# Altium schematic sheet lv.SchDoc
size A3
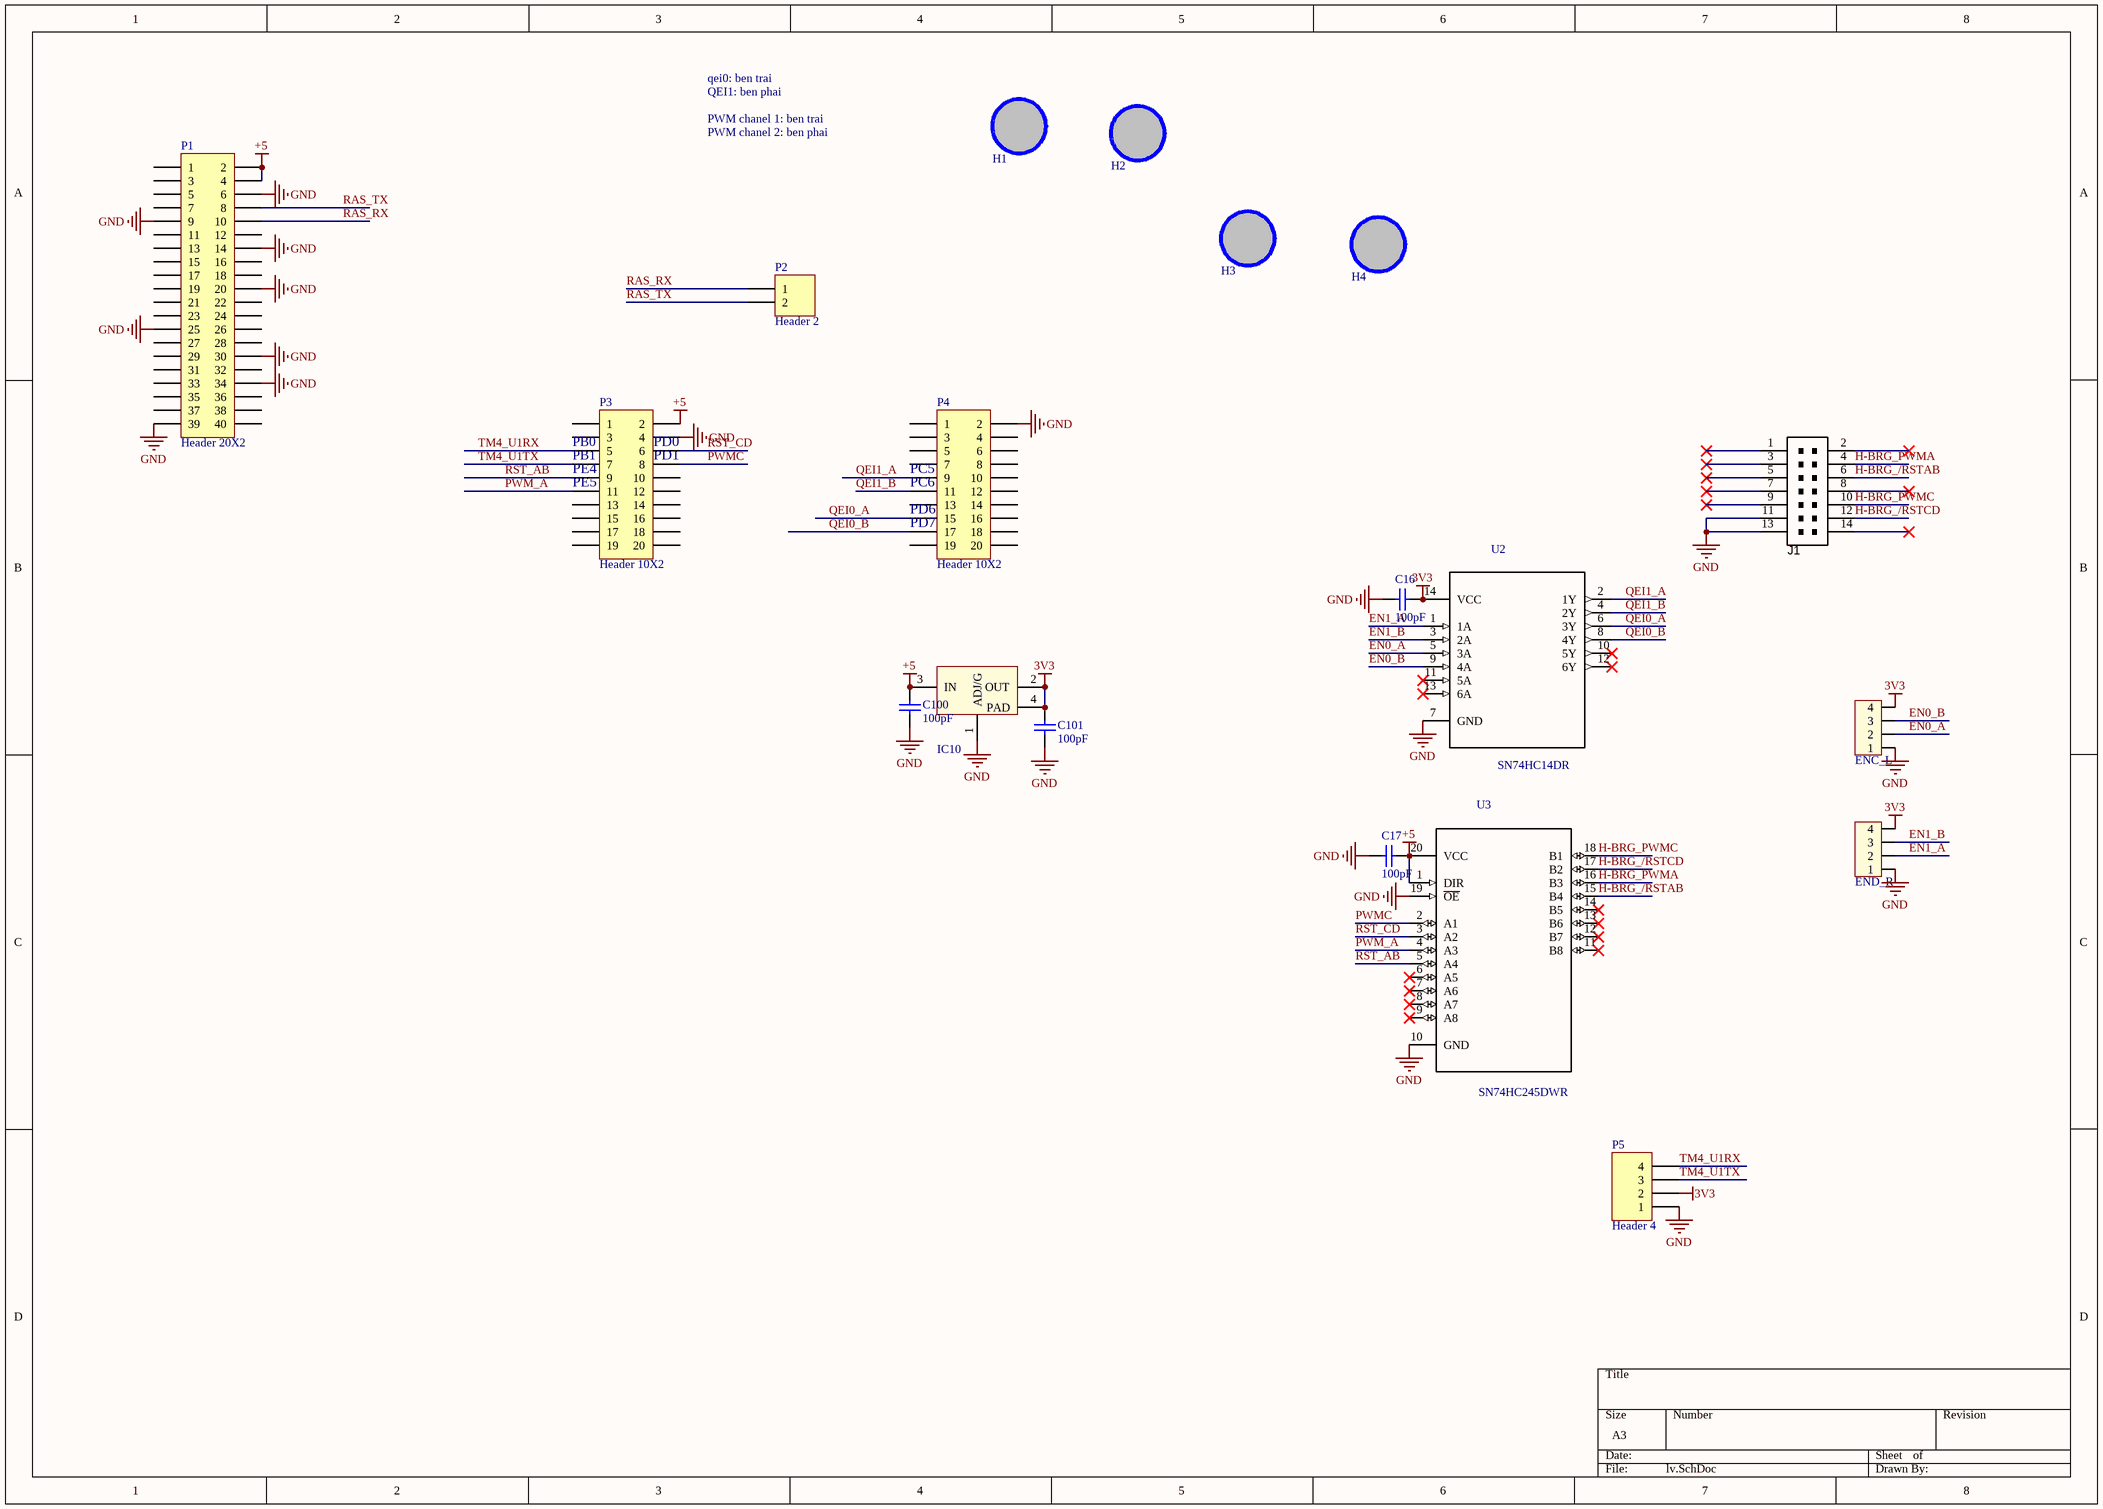
[diagram p0: lv.SchDoc]

## Parts
C16  value 100pF  [CAP-SM-0805]  (hidden comment: Cap Non-Pol SMD)
C17  value 100pF  [CAP-SM-0805]  (hidden comment: Cap Non-Pol SMD)
C100  value 100pF  [CAP-SM-0805]  (hidden comment: Cap Non-Pol SMD)
C101  value 100pF  [CAP-SM-0805]  (hidden comment: Cap Non-Pol SMD)
ENC_L1  ENC_L  [CON4]
END_R1  END_R  [CON4]
H1  Hole  [LO KHOAN 3MM]  (value not drawn)
H2  Hole  [LO KHOAN 3MM]  (value not drawn)
H3  Hole  [LO KHOAN 3MM]  (value not drawn)
H4  Hole  [LO KHOAN 3MM]  (value not drawn)
IC10  LM1117  [SOT223-4N]  (value not drawn)
J1  shrouded box header  [14P_PCB_HEADER_BRD_MNT_RA]  (value not drawn)
P1  Header 20X2  [HDR2X20]
P2  Header 2  [HDR1X2]
P3  Header 10X2  [HDR2X10]
P4  Header 10X2  [HDR2X10]
P5  Header 4  [HDR1X4]
U2  SN74HC14DR  [*SOIC127P600X175-14N]
U3  SN74HC245DWR  [*SOIC127P1030X265-20N]

## Nets
3V3: C16.1 C101.2 ENC_L1.4 END_R1.4 IC10.2(OUT) IC10.4(PAD) P5.2 U2.14(VCC)
+5: C17.1 C100.2 IC10.3(IN) P1.2 P1.4 P3.2 U3.1(DIR) U3.20(VCC)
GND: C16.2 C17.2 C100.1 C101.1 ENC_L1.1 END_R1.1 IC10.1(ADJ/G) J1.11 J1.13 P1.6 P1.9 P1.14 P1.20 P1.25 P1.30 P1.34 P1.39 P3.4 P4.2 P5.1 U2.7(GND) U3.10(GND) U3.19(~{OE})
EN0_A: ENC_L1.2 U2.5(3A)
EN0_B: ENC_L1.3 U2.9(4A)
EN1_A: END_R1.2 U2.1(1A)
EN1_B: END_R1.3 U2.3(2A)
H-BRG_/RSTAB: J1.6 U3.15(B4)
H-BRG_/RSTCD: J1.12 U3.17(B2)
H-BRG_PWMA: J1.4 U3.16(B3)
H-BRG_PWMC: J1.10 U3.18(B1)
PWM_A: P3.11 U3.4(A3)
PWMC: P3.8 U3.2(A1)
QEI0_A: P4.15 U2.6(3Y)
QEI0_B: P4.17 U2.8(4Y)
QEI1_A: P4.9 U2.2(1Y)
QEI1_B: P4.11 U2.4(2Y)
RAS_RX: P1.10 P2.1
RAS_TX: P1.8 P2.2
RST_AB: P3.9 U3.5(A4)
RST_CD: P3.6 U3.3(A2)
TM4_U1RX: P3.5 P5.4
TM4_U1TX: P3.7 P5.3

Not connected (* = marked no-connect by the designer): H1 1; H2 1; H3 1; H4 1; J1 1* 2* 3* 5* 7* 8* 9* 14*; P1 1 3 5 7 11 12 13 15 16 17 18 19 21 22 23 24 26 27 28 29 31 32 33 35 36 37 38 40; P3 1 3 10 12 13 14 15 16 17 18 19 20; P4 1 3 4 5 6 7 8 10 12 13 14 16 18 19 20; U2 10(5Y)* 11(5A)* 12(6Y)* 13(6A)*; U3 6(A5)* 7(A6)* 8(A7)* 9(A8)* 11(B8)* 12(B7)* 13(B6)* 14(B5)*

## Notes on the sheet
- qei0: ben trai
- QEI1: ben phai
- PWM chanel 1: ben trai
- PWM chanel 2: ben phai
- (near P3) PB0
- (near P3) PD0
- (near P3) PE4
- (near P3) PE5
- (near P3) PB1
- (near P3) PD1
- (near P4) PC5
- (near P4) PC6
- (near P4) PD6
- (near P4) PD7

## Library data of the parts
C16 C17 C100 C101 = Cap Non-Pol SMD: Capacitor
ENC_L1 END_R1 = Con4: Connector 4; Value: Connector 4
H1-H4 = Hole: Hole 3mm
IC10 = LM1117: Available in 1.8V, 2.5V, 2.85V, 3.3V, 5V, and  Adjustable Versions; Value: LM317
J1 = CONN_HEADER_2x7P_RA_0.100in_Male: Header THD 14 POS Double-row right-angle 2.54mm pitch; Manufacturer 1: 3M; Manufacturer Part Number 1: D2514-5002-AR; Pitch: 0.100" (2.54mm); Value: Double-row, 14 positions; QtyOverride: 1; Connector Type: Header, Shrouded; Number of Positions: 14; SCDType: source; Package / Case: Connector header; 2.54mm pitch; Contact Type: Male Pin; Number of Rows: 2; Row Spacing: 0.100" (2.54mm); Contact Mating Length: 0.243" (6.17mm); ComponentLink1URL: http://multimedia.3m.com/mws/mediawebserver?66666UuZjcFSLXTtm8T_oxMcEVuQEcuZgVs6EVs6E666666--; ComponentLink1Description: http://multimedia.3m.com/mws/mediawebserver?66666UuZjcFSLXTtm8T_oxMcEVuQEcuZgVs6EVs6E666666--; Supplier 1: Digi-Key; Supplier Part Number 1: MHE14E-ND
P1 = Header 20X2: Header, 20-Pin, Dual row; LatestRevisionDate: 17-Jul-2002; LatestRevisionNote: Re-released for DXP Platform.; Publisher: Altium Limited
P2 = Header 2: Header, 2-Pin; LatestRevisionDate: 17-Jul-2002; LatestRevisionNote: Re-released for DXP Platform.; Publisher: Altium Limited
P3 P4 = Header 10X2: Header, 10-Pin, Dual row; LatestRevisionDate: 17-Jul-2002; LatestRevisionNote: Re-released for DXP Platform.; Publisher: Altium Limited
P5 = Header 4: Header, 4-Pin; LatestRevisionDate: 17-Jul-2002; LatestRevisionNote: Re-released for DXP Platform.; Publisher: Altium Limited
U2 = SN74HC14DR: Inverter Schmitt Trigger 6-Element CMOS 14-Pin SOIC T/R; MF: Texas Instruments; Price: None; Availability: Unavailable; MP: SN74HC14DR; Package: SOIC-14 Texas Instruments; SnapEDA_Link: https://www.snapeda.com/parts/SN74HC14DR/Texas%20Instruments/view-part/?ref=snap; Value: *
U3 = SN74HC245DWR: Logic IC - Receiver, transceiver Texas Instruments SN74HC245DWR SOIC 20; Price: None; Availability: Unavailable; MP: SN74HC245DWR; Package: SOIC-20 Texas Instruments; SnapEDA_Link: https://www.snapeda.com/parts/SN74HC245DWR/Texas%20Instruments/view-part/?ref=snap; MF: Texas Instruments; Value: *